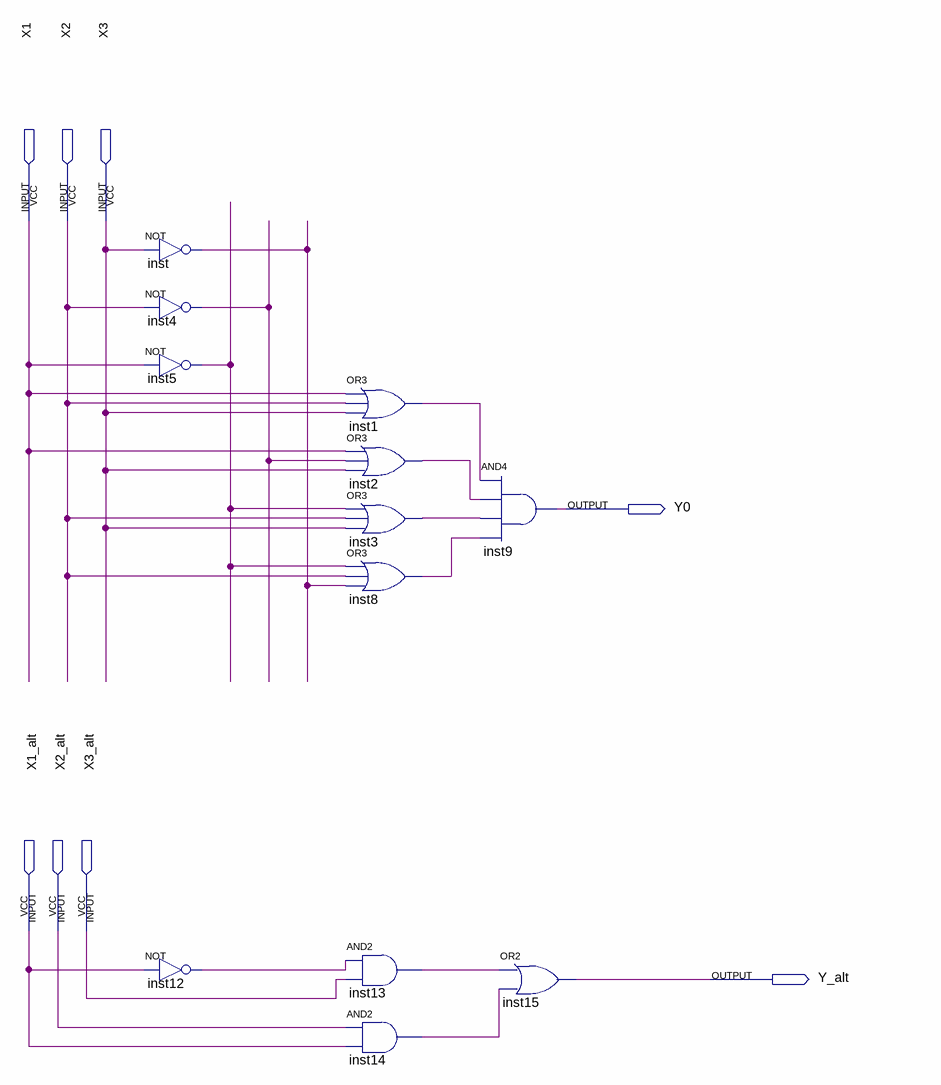
[diagram p0: schematic sheet]
// Quartus schematic proj.bdf as structural Verilog: 12 symbols, 8 pins
module proj (
  input  X1,
  input  X2,
  input  X3,
  input  X1_alt,
  input  X2_alt,
  input  X3_alt,
  output Y0,
  output Y_alt
);

  wire inst1_out, inst2_out, inst3_out, inst4_out, inst5_out, inst8_out, inst12_out, inst13_out, inst14_out,
       inst_out;

  not inst (inst_out, X3);
  not inst4 (inst4_out, X2);
  not inst5 (inst5_out, X1);
  not inst12 (inst12_out, X1_alt);
  or inst1 (inst1_out, X1, X2, X3);
  or inst2 (inst2_out, X1, inst4_out, X3);
  or inst3 (inst3_out, inst5_out, X2, X3);
  or inst8 (inst8_out, inst5_out, X2, inst_out);
  and inst13 (inst13_out, inst12_out, X3_alt);
  and inst14 (inst14_out, X2_alt, X1_alt);
  and inst9 (Y0, inst1_out, inst2_out, inst3_out, inst8_out);
  or inst15 (Y_alt, inst13_out, inst14_out);
endmodule
